# EAGLE design spot_check (EAGLE 9.6.2)
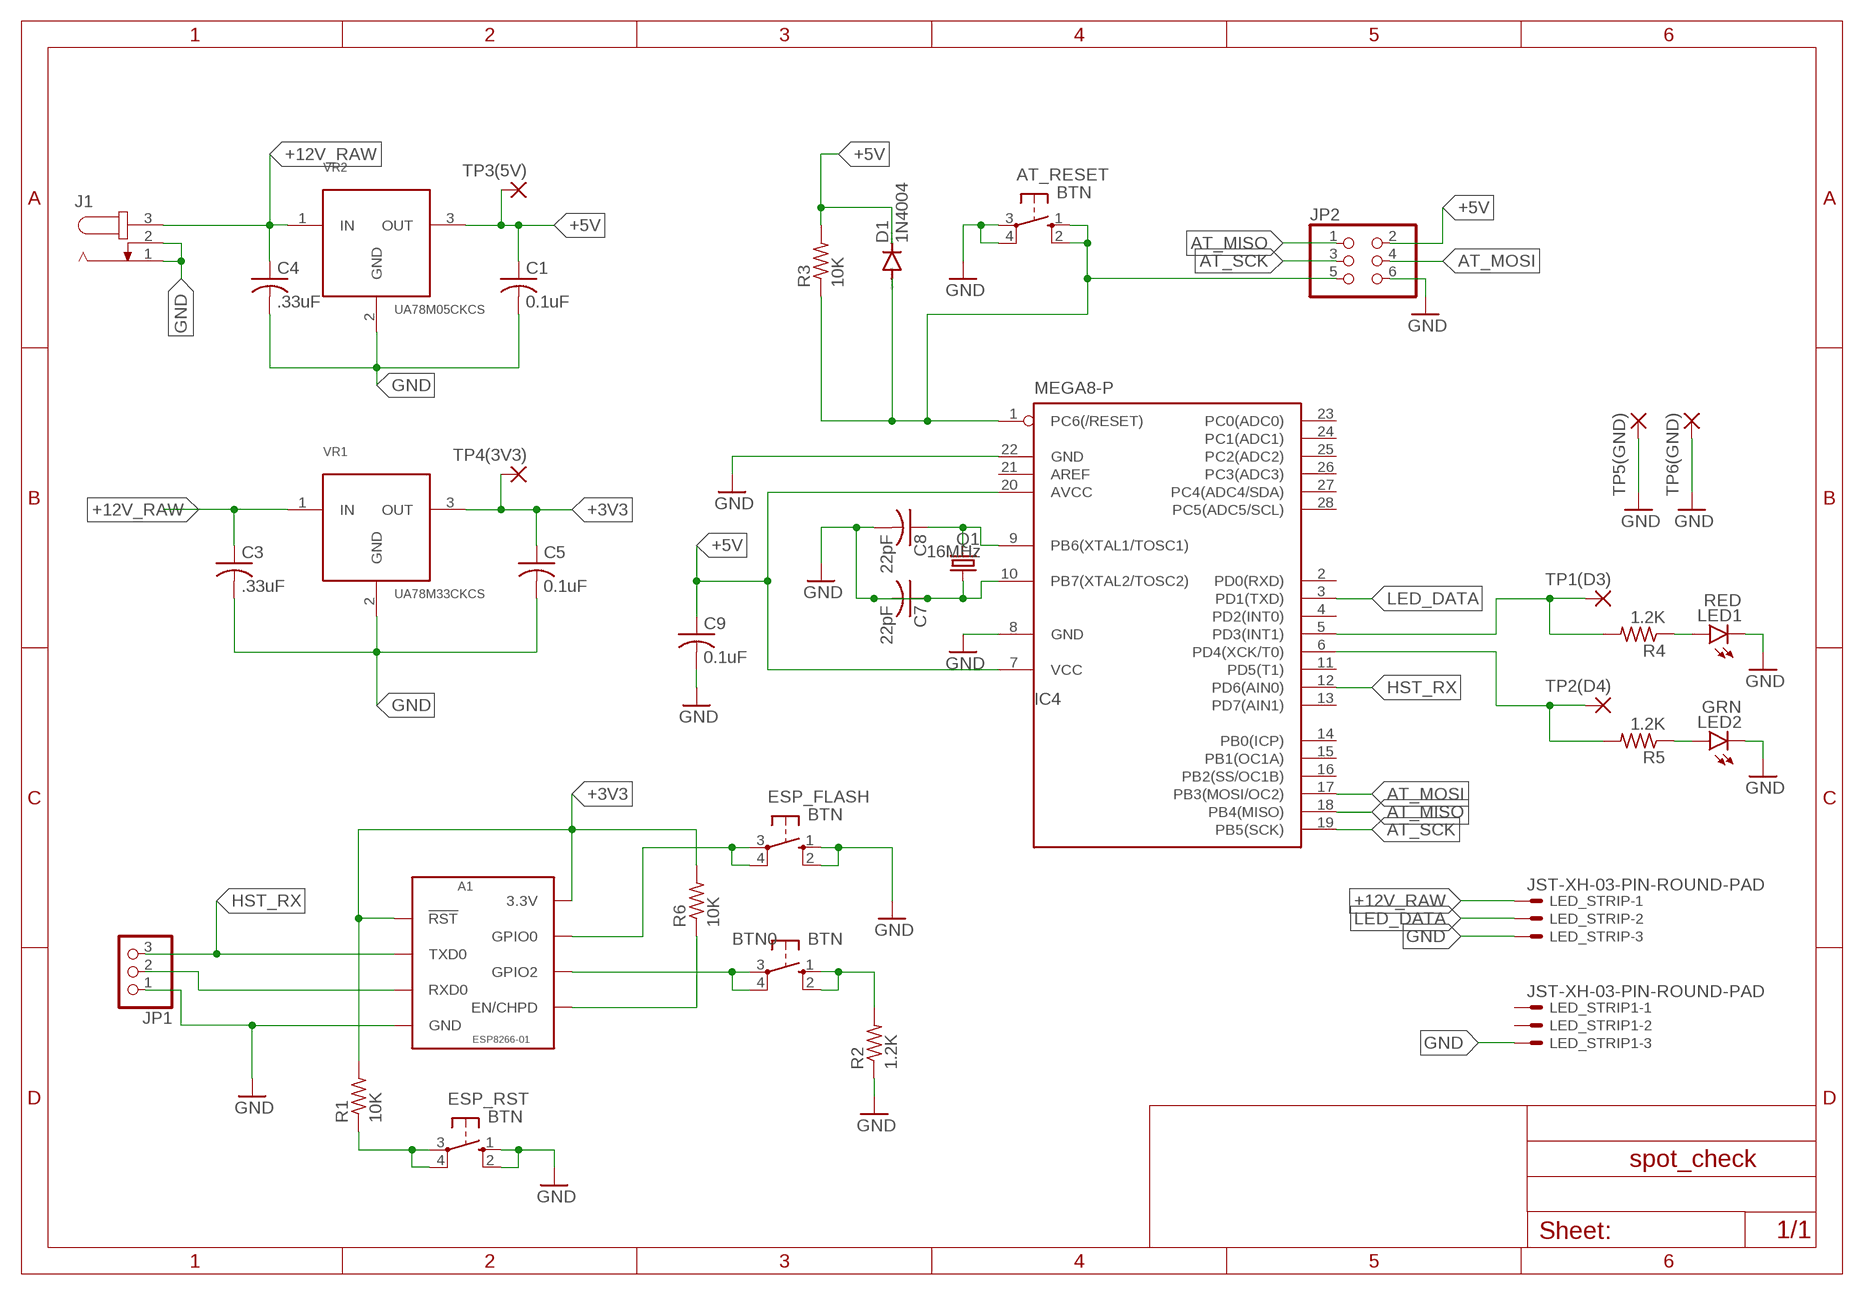
[diagram p0: schematic, sheet 1]

## Parts
A1  ESP8266-01  ESP8266_ESP-01  [ESP8266_ESP-01_NO-SILKSCREEN]
AT_RESET  BTN  10-XX  [B3F-10XX]
BTN0  BTN  10-XX  [B3F-10XX]
C1  0.1uF  C-US050-024X044  [C050-024X044]
C3  .33uF  C-US050-024X044  [C050-024X044]
C4  .33uF  C-US050-024X044  [C050-024X044]
C5  0.1uF  C-US050-024X044  [C050-024X044]
C7  22pF  C-US050-024X044  [C050-024X044]
C8  22pF  C-US050-024X044  [C050-024X044]
C9  0.1uF  C-US050-024X044  [C050-024X044]
D1  1N4004  [DO41-10]
ESP_FLASH  BTN  10-XX  [B3F-10XX]
ESP_RST  BTN  10-XX  [B3F-10XX]
IC4  MEGA8-P  [DIL28-3]
J1  JACK-PLUG1  [SPC4078]
JP1  PINHD-1X3/90  [1X03/90]
JP2  PINHD-2X3  [2X03]
LED1  RED  LED5MM  [LED5MM]
LED2  GRN  LED5MM  [LED5MM]
LED_STRIP  JST-XH-03-PIN-ROUND-PAD  [JST-XH-03-PACKAGE-ROUND-PAD]
LED_STRIP1  JST-XH-03-PIN-ROUND-PAD  [JST-XH-03-PACKAGE-ROUND-PAD]
Q1  16MHz  CRYSTALHC49S  [HC49/S]
R1  10K  R-US_0207/10  [0207/10]
R2  1.2K  R-US_0207/10  [0207/10]
R3  10K  R-US_0207/10  [0207/10]
R4  1.2K  R-US_0207/10  [0207/10]
R5  1.2K  R-US_0207/10  [0207/10]
R6  10K  R-US_0207/10  [0207/10]
TP1(D3)  2,54/0,8  [2,54/0,8]
TP2(D4)  2,54/0,8  [2,54/0,8]
TP3(5V)  2,54/0,8  [2,54/0,8]
TP4(3V3)  2,54/0,8  [2,54/0,8]
TP5(GND)  2,54/0,8  [2,54/0,8]
TP6(GND)  2,54/0,8  [2,54/0,8]
VR1  UA78M33CKCS  [TO-220-3]
VR2  UA78M05CKCS  UA78M33CKCS  [TO-220-3]

## Nets
+3V3: A1.3V3(3.3V) A1.RST(!RST!) C5.1 R1.2 R6.2 TP4(3V3).1(P) VR1.3(OUT)
+5V: C1.1 C9.1 D1.C IC4.7(VCC) IC4.20(AVCC) JP2.2 R3.2 TP3(5V).1(P) VR2.3(OUT)
+12V_RAW: C3.1 C4.1 J1.3 LED_STRIP.1 VR1.1(IN) VR2.1(IN)
AT_MISO: IC4.18(PB4(MISO)) JP2.1
AT_MOSI: IC4.17(PB3(MOSI/OC2)) JP2.4
AT_SCK: IC4.19(PB5(SCK)) JP2.3
GND: A1.GND AT_RESET.3(P) AT_RESET.4(P1) C1.2 C3.2 C4.2 C5.2 C7.1 C7.2 C8.2 C9.2 ESP_FLASH.1(S) ESP_FLASH.2(S1) ESP_RST.1(S) ESP_RST.2(S1) IC4.8(GND) IC4.10(PB7(XTAL2/TOSC2)) IC4.22(GND) J1.1 J1.2 JP1.1 JP2.6 LED1.K(C) LED2.K(C) LED_STRIP1.3 LED_STRIP.3 Q1.1 R2.1 TP5(GND).1(P) TP6(GND).1(P) VR1.2(GND) VR2.2(GND)
HST_RX: A1.TX(TXD0) IC4.12(PD6(AIN0)) JP1.3
HST_TX: A1.RX(RXD0) JP1.2
LED_DATA: IC4.3(PD1(TXD)) LED_STRIP.2
N$1: A1.EN/CH_PD(EN/CHPD) R6.1
N$2: A1.GPIO2 BTN0.3(P) BTN0.4(P1)
N$3: LED1.A R4.1
N$4: BTN0.1(S) BTN0.2(S1) R2.2
N$5: A1.GPIO0 ESP_FLASH.3(P) ESP_FLASH.4(P1)
N$6: LED2.A R5.1
N$7: C8.1 IC4.9(PB6(XTAL1/TOSC1)) Q1.2
N$8: AT_RESET.1(S) AT_RESET.2(S1) D1.A IC4.1(PC6(/RESET)) JP2.5 R3.1
N$10: ESP_RST.3(P) ESP_RST.4(P1) R1.1
TP1(D3): IC4.5(PD3(INT1)) R4.2 TP1(D3).1(P)
TP2(D4): IC4.6(PD4(XCK/T0)) R5.2 TP2(D4).1(P)
Unconnected: IC4.2(PD0(RXD)) IC4.4(PD2(INT0)) IC4.11(PD5(T1)) IC4.13(PD7(AIN1)) IC4.14(PB0(ICP)) IC4.15(PB1(OC1A)) IC4.16(PB2(SS/OC1B)) IC4.21(AREF) IC4.23(PC0(ADC0)) IC4.24(PC1(ADC1)) IC4.25(PC2(ADC2)) IC4.26(PC3(ADC3)) IC4.27(PC4(ADC4/SDA)) IC4.28(PC5(ADC5/SCL)) LED_STRIP1.1 LED_STRIP1.2

## Library data of the parts
A1 = LuisLab-Boards:ESP8266_ESP-?; SPICEPREFIX: X
AT_RESET BTN0 ESP_FLASH ESP_RST = switch-omron:10-XX: OMRON SWITCH; MPN: B3F-1000; OC_FARNELL: 176432; OC_NEWARK: 36M3542; SPICEPREFIX: E
C1 C3-C5 C7-C9 = rcl:C-US: CAPACITOR, American symbol; SPICEPREFIX: C
D1 = diode:1N4004: DIODE general purpose rectifier, 1 A; SPICEPREFIX: D
IC4 = atmel:MEGA8-P: MICROCONTROLLER 8 Kbytes FLASH, 1 kbytes SRAM, 512 bytes EEPROM, USART, 4-channel 10 bit ADC, 2-channel 8 bit ADC Pin compatible with Atmega48, ATMega88, ATMega168 Source: avr.lbr; OC_FARNELL: unknown; OC_NEWARK: unknown; SPICEPREFIX: X
J1 = con-jack:JACK-PLUG: DC POWER JACK Power Jack, DC, Right Angle, Through Hole, Rated 5A at 16VDC, PC Terminals Distributor: Farnell (www.Farnell.de) Drawing: 84N1161.pdf / 84N1162.pdf Manufacturer: SPC Technology (www.spctechnology.com) Type: SPC4077 / SPC 4078; OC_FARNELL: unknown; OC_NEWARK: unknown; SPICEPREFIX: J
JP1 = pinhead:PINHD-1X3: PIN HEADER; SPICEPREFIX: J
JP2 = pinhead:PINHD-2X3: PIN HEADER; SPICEPREFIX: X
LED1 LED2 = led:LED: LED OSRAM: - CHIPLED LG R971, LG N971, LY N971, LG Q971, LY Q971, LO R971, LY R971 LH N974, LH R974 LS Q976, LO Q976, LY Q976 LO Q996 - Hyper CHIPLED LW Q18S LB Q993, LB Q99A, LB R99A - SideLED LS A670, LO A670, LY A670, LG A670, LP A670 LB A673, LV A673, LT A673, LW A673 LH A674 LY A675 LS A676, LA A676, LO A676, LY A676, LW A676 LS A679, LY A679, LG A679 - Hyper Micro SIDELED® LS Y876, LA Y876, LO Y876, LY Y876 LT Y87S - SmartLED LW L88C, LW L88S LB L89C, LB L89S, LG L890 LS L89K, LO L89K, LY L89K LS L896, LA L896, LO L896, LY L896 - TOPLED LS T670, LO T670, LY T670, LG T670, LP T670 LSG T670, LSP T670, LSY T670, LOP T670, LYG T670 LG T671, LOG T671, LSG T671 LB T673, LV T673, LT T673, LW T673 LH T674 LS T676, LA T676, LO T676, LY T676, LB T676, LH T676, LSB T676, LW T676 LB T67C, LV T67C, LT T67C, LS T67K, LO T67K, LY T67K, LW E67C LS E67B, LA E67B, LO E67B, LY E67B, LB E67C, LV E67C, LT E67C LW T67C LS T679, LY T679, LG T679 LS T770, LO T770, LY T770, LG T770, LP T770 LB T773, LV T773, LT T773, LW T773 LH T774 LS E675, LA E675, LY E675, LS T675 LS T776, LA T776, LO T776, LY T776, LB T776 LHGB T686 LT T68C, LB T68C - Hyper Mini TOPLED® LB M676 - Mini TOPLED Santana® LG M470 LS M47K, LO M47K, LY M47K Source: http://www.osram.convergy.de LUXEON: - LUMILED® LXK2-PW12-R00, LXK2-PW12-S00, LXK2-PW14-U00, LXK2-PW14-V00 LXK2-PM12-R00, LXK2-PM12-S00, LXK2-PM14-U00 LXK2-PE12-Q00, LXK2-PE12-R00, LXK2-PE12-S00, LXK2-PE14-T00, LXK2-PE14-U00 LXK2-PB12-K00, LXK2-PB12-L00, LXK2-PB12-M00, LXK2-PB14-N00, LXK2-PB14-P00, LXK2-PB14-Q00 LXK2-PR12-L00, LXK2-PR12-M00, LXK2-PR14-Q00, LXK2-PR14-R00 LXK2-PD12-Q00, LXK2-PD12-R00, LXK2-PD12-S00 LXK2-PH12-R00, LXK2-PH12-S00 LXK2-PL12-P00, LXK2-PL12-Q00, LXK2-PL12-R00 Source: www.luxeon.com KINGBRIGHT: KA-3528ASYC Source: www.kingbright.com; SPICEPREFIX: L
LED_STRIP LED_STRIP1 = Rembrandt Electronics - JST XH Connectors v1-0:JST-XH-03-PIN: JST XH Connector 2 Pin Wire to board connector. Pitch: 2,54 mm, (0.100") Number of pins: 3 Created by Rembrandt Electronics www.rembrandtelectronics.com; SPICEPREFIX: X
Q1 = crystal:CRYSTAL: CRYSTAL; OC_FARNELL: 1667008; OC_NEWARK: unknown; SPICEPREFIX: B
R1-R6 = rcl:R-US_: RESISTOR, American symbol; SPICEPREFIX: R
TP1(D3) TP2(D4) TP3(5V) TP4(3V3) TP5(GND) TP6(GND) = wirepad:2,54/0,8: THROUGH-HOLE PAD; SPICEPREFIX: X
VR1 VR2 = TO-220-3:UA78M33CKCS; SPICEPREFIX: J

## Board
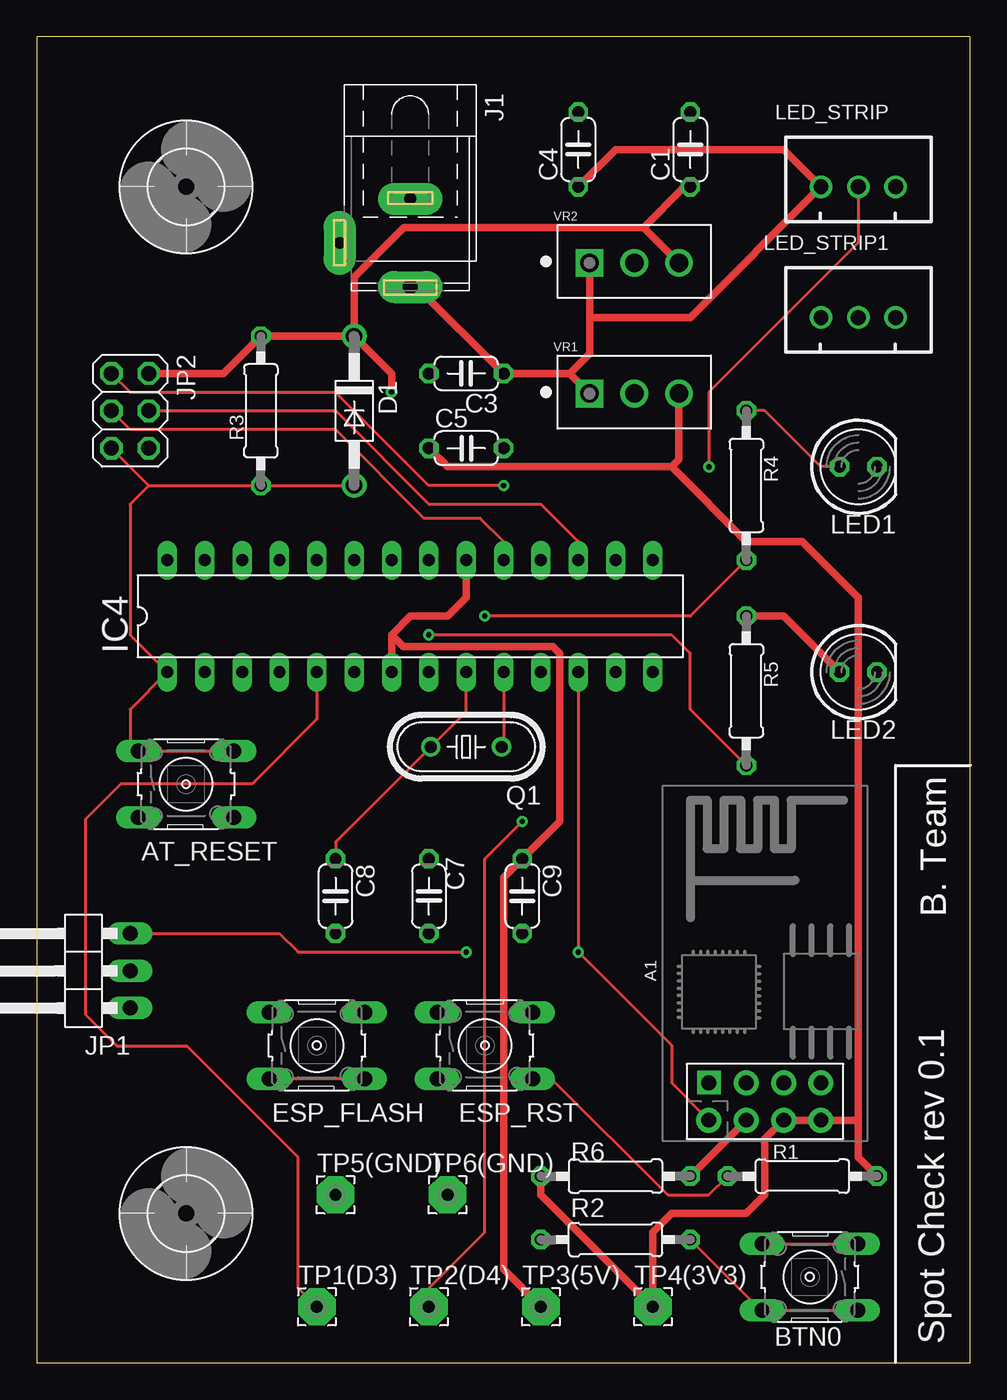
[diagram p1: board, top side]
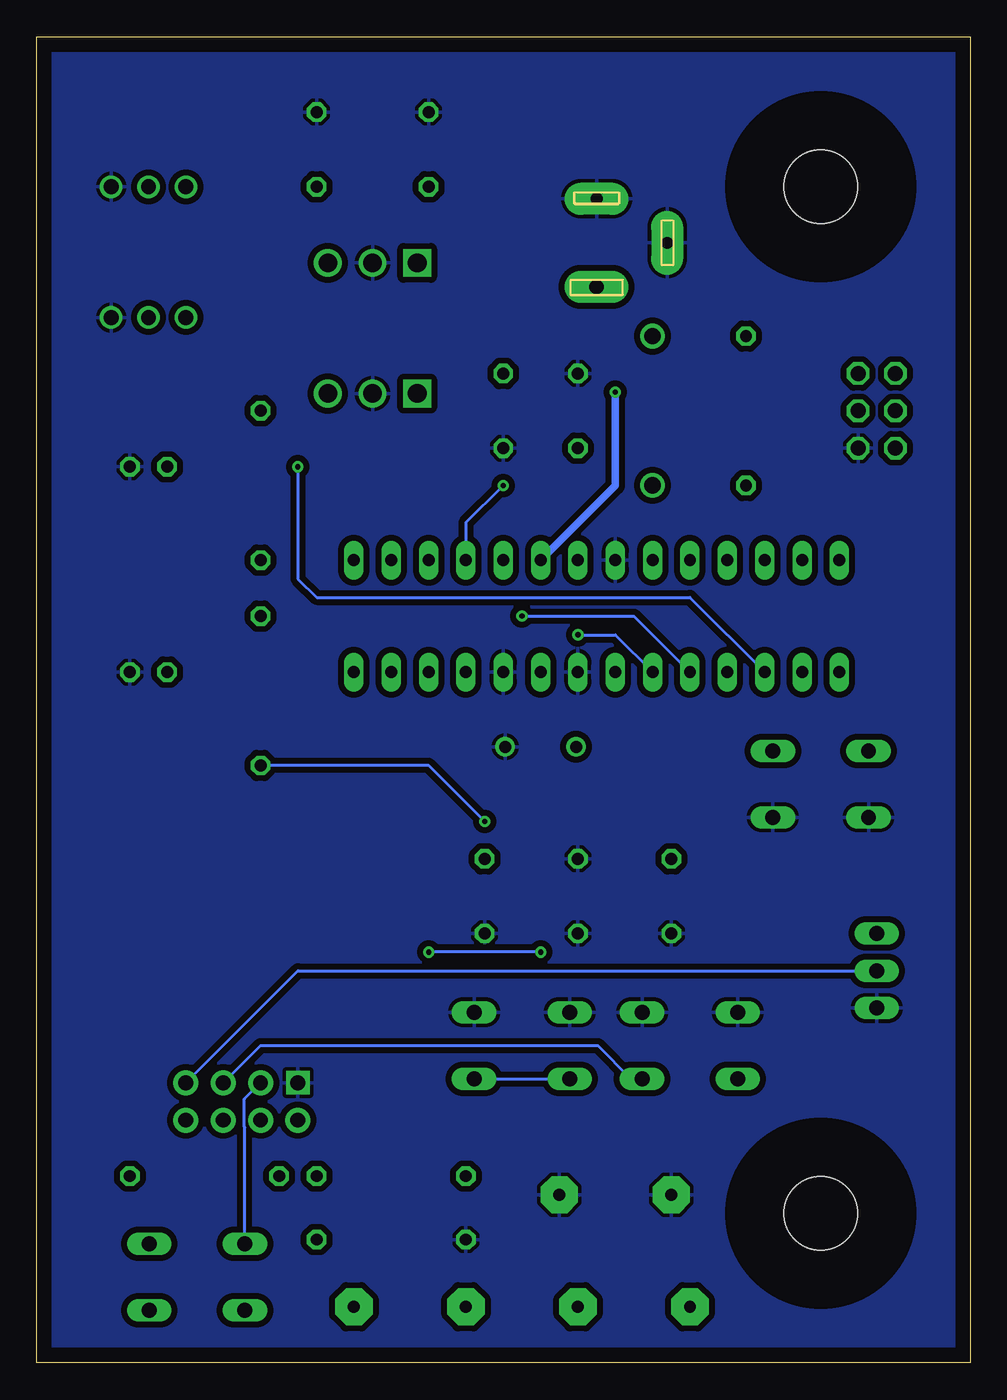
[diagram p2: board, bottom side, seen from below]

Size 63.48 x 90.22 mm. Coordinates in mm from the lower left corner, seen from the top.
Outline: 0,0 63.48,0 63.48,90.22 0,90.22 0,0
Copper layers (1*16): Top 0.035mm / dielectric 1.5mm / Bottom 0.035mm
Design rules "default": minimum track width 6mil, minimum drill 0.35mm, track to track 6mil, track to pad 6mil, pad to pad 6mil, via to via 6mil, smd to smd 6mil, copper to edge 40mil, drill to drill 6mil, minimum pad ring 10mil, minimum via ring 8mil, stop-mask expansion 4mil, vias tented up to drill 0mil, thermal gap 10mil
Milling: 12 lines

### Footprints (pad centres in the part's own frame; a part is rotated, then mirrored left to right if it is on the bottom)
ESP8266_ESP-01_NO-SILKSCREEN = drill 1.016 pad 1.7: 3V3 -1.27,-3.81; EN/CH_PD -1.27,1.27; GPIO0 1.27,-1.27; GPIO2 1.27,1.27; RST -1.27,-1.27; RX 1.27,-3.81; TX -1.27,3.81 | drill 1.016 pad 1.6 square: GND 1.27,3.81
B3F-10XX = drill 1.016 long: 1 -3.251,2.261; 2 3.251,2.261; 3 -3.251,-2.261; 4 3.251,-2.261
C050-024X044 = drill 0.813 octagon: 1 -2.54,0; 2 2.54,0
DO41-10 = drill 1.118: A 5.08,0; C -5.08,0
DIL28-3 = drill 0.813 long: 1 -16.51,-3.81; 2 -13.97,-3.81; 3 -11.43,-3.81; 4 -8.89,-3.81; 5 -6.35,-3.81; 6 -3.81,-3.81; 7 -1.27,-3.81; 8 1.27,-3.81; 9 3.81,-3.81; 10 6.35,-3.81; 11 8.89,-3.81; 12 11.43,-3.81; 13 13.97,-3.81; 14 16.51,-3.81; 15 16.51,3.81; 16 13.97,3.81; 17 11.43,3.81; 18 8.89,3.81; 19 6.35,3.81; 20 3.81,3.81; 21 1.27,3.81; 22 -1.27,3.81; 23 -3.81,3.81; 24 -6.35,3.81; 25 -8.89,3.81; 26 -11.43,3.81; 27 -13.97,3.81; 28 -16.51,3.81
SPC4078 = drill 0.8 pad 2.184 long: 1 -3,0; 2 0,-4.8 | drill 1 pad 2.184 long: 3 3,0
1X03/90 = drill 1.016 long: 1 -2.54,-3.81; 2 0,-3.81; 3 2.54,-3.81
2X03 = drill 1.016 octagon: 1 -2.54,-1.27; 2 -2.54,1.27; 3 0,-1.27; 4 0,1.27; 5 2.54,-1.27; 6 2.54,1.27
LED5MM = drill 0.813 octagon: A -1.27,0; K 1.27,0
JST-XH-03-PACKAGE-ROUND-PAD = drill 1.016: 1 -2.54,0; 2 0,0; 3 2.54,0
HC49/S = drill 0.813: 1 -2.413,0; 2 2.413,0
0207/10 = drill 0.813 octagon: 1 -5.08,0; 2 5.08,0
2,54/0,8 = drill 0.813 pad 2.54 octagon: 1 0,0
5,0 = hole 5: 0,0
TO-220-3 = drill 1.26 pad 1.89 square: 1 -3.04,-0.095 | drill 1.26 pad 1.89: 2 0,-0.095; 3 3.04,-0.095

### Placement (x,y rotation side)
A1  49.53,17.78 90 top
AT_RESET  10.16,39.37 0 top
BTN0  52.58,5.84 180 top
C1  44.45,82.55 90 top
C3  29.21,67.31 180 top
C4  36.83,82.55 90 top
C5  29.21,62.23 0 top
C7  26.67,31.75 90 top
C8  20.32,31.75 270 top
C9  33.02,31.75 270 top
D1  21.59,64.77 270 top
ESP_FLASH  19.05,21.59 0 top
ESP_RST  30.48,21.59 0 top
IC4  25.4,50.8 0 top
J1  25.4,76.2 270 top
JP1  2.54,26.67 90 top
JP2  6.35,64.77 270 top
LED1  55.88,60.96 0 top
LED2  55.88,46.99 0 top
LED_STRIP  55.88,80.01 0 top
LED_STRIP1  55.88,71.12 0 top
Q1  29.21,41.91 180 top
R1  52.07,12.7 0 top
R2  39.37,8.38 0 top
R3  15.24,64.77 90 top
R4  48.26,59.69 270 top
R5  48.26,45.72 270 top
R6  39.37,12.7 180 top
TP1(D3)  19.05,3.81 0 top
TP2(D4)  26.67,3.81 0 top
TP3(5V)  34.29,3.81 0 top
TP4(3V3)  41.91,3.81 0 top
TP5(GND)  20.32,11.43 0 top
TP6(GND)  27.94,11.43 0 top
U$1  [5,0]  10.16,80.01 0 top
U$2  [5,0]  10.16,10.16 0 top
VR1  40.64,66.04 0 top
VR2  40.64,74.93 0 top

### Tracks (layer width: path | path; a pad name or v marks a point on that pad's centre or on a via)
+3V3
  Top 0.508: VR1.3 43.68,61.46 43.18,60.96 | 43.18,60.96 27.94,60.96 C5.1 | R1.2 55.88,13.97 55.88,16.51 | 43.18,60.96 48.26,55.88 52.07,55.88 55.88,52.07 55.88,16.51 | 55.88,16.51 A1.3V3 A1.RST 49.53,15.24 49.53,11.43 48.26,10.16 43.18,10.16 41.91,8.89 TP4(3V3).1 34.29,11.43 R6.2
+5V  (via drill 0.35)
  Top 0.508: D1.C 21.59,73.87 24.96,77.24 41.28,77.24 | D1.C R3.2 12.7,67.31 JP2.2 | IC4.20 29.21,52.07 27.94,50.8 25.4,50.8 24.13,49.53 | 24.13,49.53 IC4.7 | v24.13,66.04 24.13,67.31 D1.C | 24.13,49.53 24.94,48.72 35.1,48.72 35.56,48.26 35.56,36.83 C9.1 31.75,33.02 31.75,6.35 TP3(5V).1 | VR2.3 41.28,77.24 | 41.28,77.24 44.05,80.01 C1.1
  Bottom 0.508: v24.13,66.04 24.13,59.69 IC4.20
+12V_RAW
  Top 0.508: J1.3 25.86,73.2 C3.1 36.24,67.31 | 36.24,67.31 VR1.1 | 36.24,67.31 37.6,68.67 37.6,71.12 | 37.6,71.12 VR2.1 | 37.6,71.12 44.45,71.12 LED_STRIP.1 50.8,82.55 39.37,82.55 C4.1
AT_MISO  (via drill 0.35)
  Top 0.203: JP2.1 6.35,66.04 20.3,66.04 25.02,61.32 25.04,61.32 26.67,59.69 v31.75,59.69
  Bottom 0.203: v31.75,59.69 34.29,57.15 IC4.18
AT_MOSI
  Top 0.203: JP2.4 20.32,64.77 26.67,58.42 34.29,58.42 36.83,55.88 IC4.17
AT_SCK
  Top 0.203: IC4.19 31.75,55.88 30.18,57.45 26.36,57.45 20.32,63.5 6.35,63.5 JP2.3
GND
  Top 0.203: IC4.10 31.75,42.04 Q1.1
  pour Bottom (isolate 0.406): 0,90.17 0,0 63.5,0 63.5,90.17
HST_RX  (via drill 0.35)
  Top 0.203: JP1.3 16.51,29.21 17.78,27.94 v29.21,27.94 | IC4.12 v36.83,27.94 43.18,21.59 43.18,19.05 A1.TX
  Bottom 0.203: v29.21,27.94 v36.83,27.94
HST_TX
  Bottom 0.203: A1.RX 45.72,26.67 JP1.2
LED_DATA  (via drill 0.35)
  Top 0.203: LED_STRIP.2 55.88,76.2 45.72,66.04 v45.72,60.96
  Bottom 0.203: v45.72,60.96 45.72,53.34 44.45,52.07 19.05,52.07 IC4.3
N$1
  Top 0.508: A1.EN/CH_PD R6.1
N$2
  Top 0.203: BTN0.4 BTN0.3
  Bottom 0.203: BTN0.4 49.33,16.02 49.36,16.05 49.36,17.95 A1.GPIO2
N$3
  Top 0.203: LED1.A 53.34,60.96 49.53,64.77 R4.1
N$4
  Top 0.203: R2.2 49.25,3.58 BTN0.2 BTN0.1
N$5
  Top 0.203: ESP_FLASH.4 ESP_FLASH.3
  Bottom 0.203: A1.GPIO0 48.26,21.59 25.32,21.59 23.06,19.33 ESP_FLASH.4
N$6
  Top 0.508: R5.1 50.8,50.8 LED2.A
N$7
  Top 0.203: IC4.9 29.21,44.32 Q1.2 20.32,35.43 C8.1
N$8
  Top 0.203: JP2.5 7.62,59.69 | 7.62,59.69 R3.1 D1.A | 7.62,59.69 6.35,58.42 6.35,49.53 IC4.1 6.35,44.45 6.35,42.19 AT_RESET.1 AT_RESET.2
N$10
  Top 0.203: ESP_RST.4 35,19.33 42.9,11.43 45.72,11.43 R1.1
  Bottom 0.203: ESP_RST.4 ESP_RST.3
TP1(D3)  (via drill 0.35)
  Top 0.203: IC4.5 19.05,43.8 14.64,39.39 5.73,39.39 3.3,36.97 3.3,23.71 5.45,21.57 10.18,21.57 17.78,13.97 17.78,5.08 TP1(D3).1 | R4.2 44.45,50.8 v30.48,50.8
  Bottom 0.203: v30.48,50.8 22.86,50.8 IC4.5
TP2(D4)  (via drill 0.35)
  Top 0.203: R5.2 44.45,44.45 44.45,48.26 43.18,49.53 v26.67,49.53 | TP2(D4).1 26.67,5.08 30.48,8.89 30.48,34.29 v33.02,36.83
  Bottom 0.203: v26.67,49.53 24.13,49.53 IC4.6 | v33.02,36.83 36.83,40.64 R5.2

### Text on the board
tPlace: B. Team | Spot Check rev 0.1